# Altium schematic sheet Microcontroller.SchDoc
size A; SheetNumber: 2; SheetTotal: 4
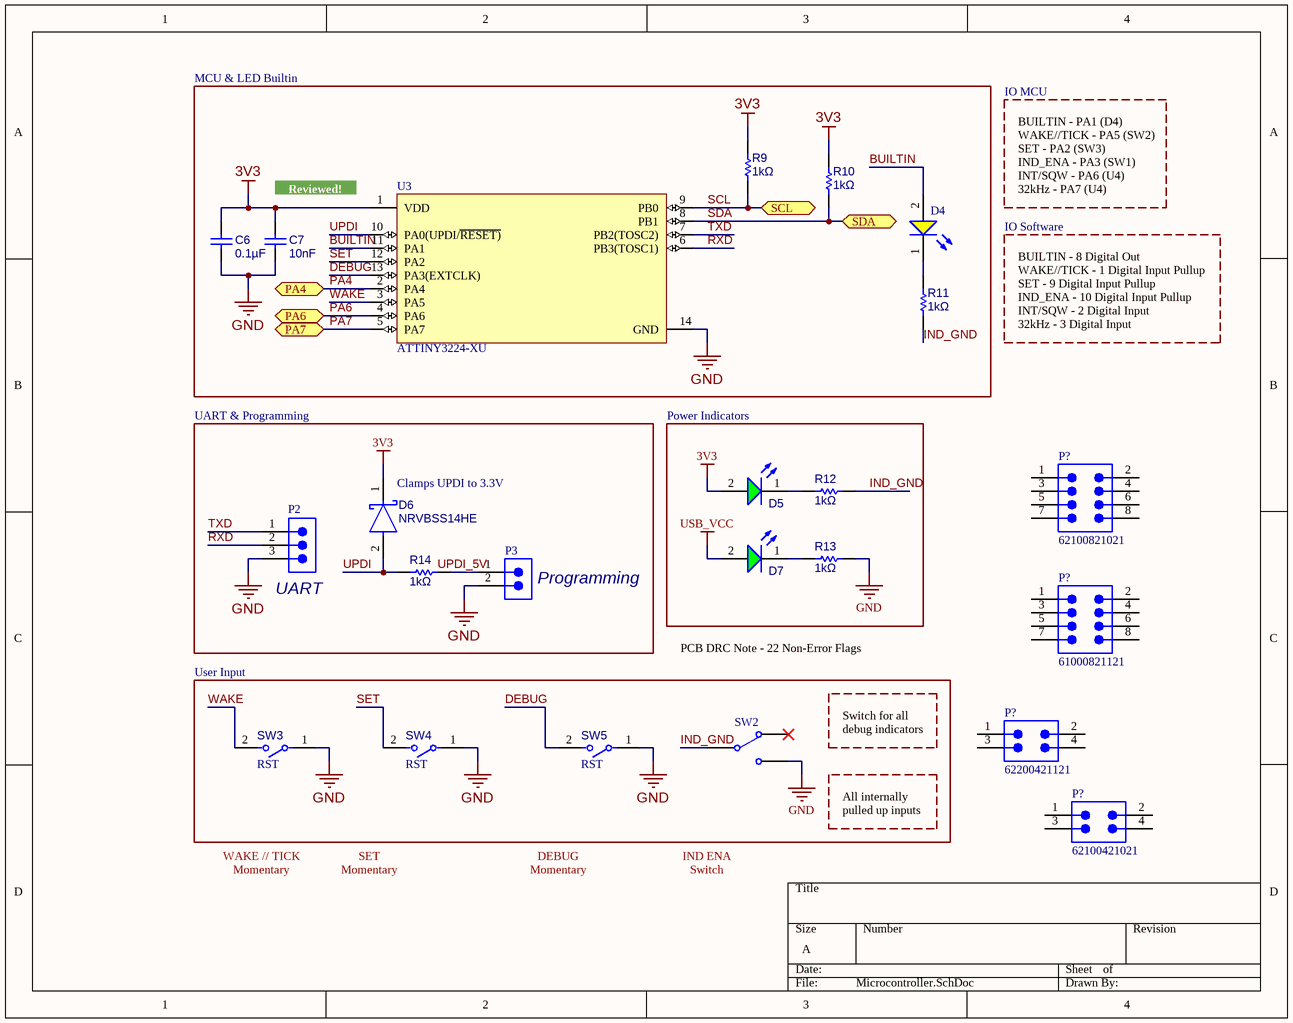
[diagram p0: Microcontroller.SchDoc]

## Parts
(Parts that share a designator on the sheet are numbered #1, #2 ... from top to bottom, then left to right.)
C6  0.1µF  [WCAP-CSGP_0603_L1.6W0.8H0.8_Reflow]
C7  10nF  [WCAP-CSGP_0603_L1.6W0.8H0.8_Reflow]
D4  150120YS75000  [WL-SMCW_1206_150120xx75000]  (value not drawn)
D5  150120GS75000  [WL-SMCW_1206_150120xx75000]  (value not drawn)
D6  NRVBSS14HE  [FP-477AD-MFG]
D7  150120GS75000  [WL-SMCW_1206_150120xx75000]  (value not drawn)
P2  61300311121  [61300311121]  (value not drawn)
P3  61300211121  [61300211121]  (value not drawn)
P?#1  62100821021  [62100821021]
P?#2  61000821121  [61000821121]
P?#3  62200421121  [62200421121]
P?#4  62100421021  [62100421021]
R9  1kΩ  [RESC1608X55X25NL10T15]
R10  1kΩ  [RESC1608X55X25NL10T15]
R11  1kΩ  [RESC1608X55X25NL10T15]
R12  1kΩ  [RESC1608X55X25NL10T15]
R13  1kΩ  [RESC1608X55X25NL10T15]
R14  1kΩ  [RESC1608X55X25NL10T15]
SW2  450404015514  [450404015514]  (value not drawn)
SW3  RST  [FP-B3U-1000P-B-MFG]
SW4  RST  [FP-B3U-1000P-B-MFG]
SW5  RST  [FP-B3U-1000P-B-MFG]
U3  ATTINY3224-XU  [FP-C04-087-ST-MFG]

## Blocks framed on the sheet
MCU & LED Builtin: C6 C7 D4 R9-R11 U3
Power Indicators: D5 D7 R12 R13
User Input: SW2-SW5

## Ports
PA4 (bidir), PA6 (bidir), PA7 (bidir), SCL (bidir, see Display[2B], ICs[2C], ICs[3B], ICs[4B], ICs[4C]), SDA (bidir, see Display[2B], ICs[2C], ICs[3B], ICs[4B], ICs[4C])

## Nets
3V3: C6.2 C7.2 D5.2(A) D6.1(C) R9.2 R10.2 U3.1(VDD)
GND: C6.1 C7.1 P2.3 P3.2 R13.1 SW2.L2 SW3.1 SW4.1 SW5.1 U3.14(GND)
USB_VCC: D7.2(A)
BUILTIN: D4.2(A) U3.11(PA1)
DEBUG: SW5.2 U3.13(PA3(EXTCLK))
IND_GND: R11.1 R12.1 SW2.COM
PA4: U3.2(PA4) ; port PA4
PA6: U3.4(PA6) ; port PA6
PA7: U3.5(PA7) ; port PA7
RXD: P2.2 U3.6(PB3(TOSC1))
SCL: R9.1 U3.9(PB0) ; port SCL
SDA: R10.1 U3.8(PB1) ; port SDA
SET: SW4.2 U3.12(PA2)
TXD: P2.1 U3.7(PB2(TOSC2))
UPDI: D6.2(A) R14.2 U3.10(PA0(UPDI/~{RESET)})
WAKE: SW3.2 U3.3(PA5)
NetD4_1: D4.1(K) R11.2
NetD5_1: D5.1(K) R12.2
NetD7_1: D7.1(K) R13.2
NetP3_1: P3.1 R14.1

Not connected (* = marked no-connect by the designer): P?#1 1 2 3 4 5 6 7 8; P?#2 1 2 3 4 5 6 7 8; P?#3 1 2 3 4; P?#4 1 2 3 4; SW2 L1*

## Notes on the sheet
- IO MCU
- BUILTIN - PA1 (D4)
- WAKE//TICK - PA5 (SW2)
- SET - PA2 (SW3)
- IND_ENA - PA3 (SW1)
- Reviewed!
- IO Software
- INT/SQW - PA6 (U4)
- 32kHz - PA7 (U4)
- BUILTIN - 8 Digital Out
- WAKE//TICK - 1 Digital Input Pullup
- SET - 9 Digital Input Pullup
- IND_ENA - 10 Digital Input Pullup
- INT/SQW - 2 Digital Input
- 32kHz - 3 Digital Input
- UART & Programming
- (near D6) Clamps UPDI to 3.3V
- (near P2) UART
- (near P3) Programming
- PCB DRC Note - 22 Non-Error Flags
- Switch for all debug indicators
- All internally pulled up inputs
- WAKE // TICK
- Momentary
- SET
- DEBUG
- IND ENA
- Switch
- Labels drawn without touching a wire or pin: UPDI_5V

## Library data of the parts
C6 C7 = CMP-207839-000060-3: 10V tolerance
D4 = CMP-1426-00019-3: Led, Yellow, 590 Nm, 2 V, 30 Ma, 120 Mcd Rohs Compliant: Yes; Dominant Wavelength: 590nm; Forward Voltage: 2V; Forward Current: 100mA; Viewing Angle: 140°; Max Reverse Voltage (DC): 5V; Peak Wavelength: 595nm; Lens Style: Clear, Rectangular; Test Current: 20mA; Luminous Intensity: 120mcd; REACH SVHC: Unknown; Length: 3.2mm; RoHS: Compliant; Packaging: Tape and Reel; Min Operating Temperature: -40°C; Mount: Surface Mount; Max Operating Temperature: 85°C; Wavelength: 590nm; Case/Package: 1206; Case Code (Imperial): 1206; Color: Yellow; Height: 680µm; Case Code (Metric): 3216; Width: 1.6mm
D5 D7 = CMP-1426-00014-4: WL-SMCW SMT Mono-Color Chip LED Waterclear; Dominant Wavelength: 525nm; Reverse Voltage: 5V; Max Junction Temperature (Tj): 95°C; Lens Style: Clear, Rectangular; Forward Voltage: 3.2V; Power Dissipation: 105mW; Peak Wavelength: 515nm; Test Current: 20mA; Color: Green; Forward Current: 100mA; Luminous Intensity: 450mcd; Viewing Angle: 140°; Case Code (Imperial): 1206; REACH SVHC: Unknown; Packaging: Tape and Reel; Max Operating Temperature: 85°C; Case/Package: 1206; Height: 680µm; Length: 3.2mm; Mount: Surface Mount; Min Operating Temperature: -40°C; Width: 1.6mm; Case Code (Metric): 3216; Max Reverse Voltage (DC): 5V; RoHS: Compliant; Wavelength: 525nm
D6 = CMP-00278-93203856-2: NRVBSS14HE Rectifier Diode, Schottky, 1 Phase, 1 Element, 1A, 40V V(RRM), Silicon; Manufacturer Lifecycle Status: ACTIVE; Capacitance: 55pF; Max Forward Surge Current (Ifsm): 25A; Peak Reverse Current: 5µA; Max Junction Temperature (Tj): 150°C; Forward Current: 1A; Min Operating Temperature: -55°C; NexarPartId: 93203856; Reverse Voltage: 40V; Max Operating Temperature: 150°C; RoHS: Compliant; Lifecycle Status: Production; Max Repetitive Reverse Voltage (Vrrm): 40V; Height: 750µm
P2 = CMP-1502-01062-3: NexarPartId: 32855521; Current Rating: 3A; Voltage Rating: 250V; Number of Positions: 3; Pitch: 2.54mm; Contact Resistance: 20mΩ; Connector Type: Male Pin; Gender: Male; REACH SVHC: Unknown; Packaging: Bulk; Contact Material: Copper; Min Operating Temperature: -40°C; Number of Rows: 1; Orientation: Vertical; RoHS: Compliant; Contact Plating: Gold; Max Operating Temperature: 105°C; Mount: Through Hole; Height: 8.94mm; Operating Supply Voltage: 250V; Number of Pins: 3; Contact Mating Length: 5.9944mm; Number of Contacts: 3; Color: Black; Lead Free: Lead Free; Lead Pitch: 2.54mm; Termination: Solder
P3 = CMP-1712-00002-6: NexarPartId: 20081794; Number of Contacts: 2; Pitch: 2.54mm; Connector Type: Male Pin; Voltage Rating: 250V; Current Rating: 3A; Gender: Male; Contact Resistance: 20mΩ; Height: 8.94mm; Lead Free: Lead Free; Number of Pins: 2; Termination: Through Hole; RoHS: Compliant; Lead Pitch: 2.54mm; REACH SVHC: No SVHC; Housing Material: PBT; Contact Mating Length: 5.9944mm; Min Operating Temperature: -40°C; Orientation: Vertical; Contact Material: Copper; Contact Gender: Male; Max Operating Temperature: 125°C; Number of Rows: 1; Number of Positions: 2; Packaging: Bulk; Contact Plating: Gold; Mount: Through Hole; Color: Black; Operating Supply Voltage: 250V
P?#1 = CMP-1502-00926-4: Conn, Header, 8Pos, 2Row, 1.27Mm Rohs Compliant: Yes; Contact Resistance: 20mΩ; Current Rating: 1A; Operating Supply Voltage: 100V; Gender: Male; RoHS: Non-Compliant; Orientation: Vertical; Lead Pitch: 1.27mm; Number of Pins: 8
P?#2 = CMP-1502-01025-4: SMT Vertical Pin Header WR-PHD, Pitch 2.54 mm, Dual Row, 8 pins; Number of Contacts: 8; Connector Type: Male Pin; Contact Resistance: 20mΩ; Operating Supply Voltage: 250V; Gender: Male; Pitch: 2.54mm; Current Rating: 3A; Mount: Surface Mount; Lead Pitch: 2.54mm; Color: Black; RoHS: Compliant; Number of Pins: 8; Orientation: Vertical; Contact Mating Length: 5.9944mm; Number of Rows: 2; Row Spacing: 2.54mm; Termination: Solder; Number of Positions: 8; Contact Material: Copper; Contact Plating: Gold
P?#3 = CMP-1502-00946-4: THT Vertical Pin Header WR-PHD, Pitch 1.27 mm, Dual Row, 4 pins; Row Spacing: 1.27mm; Gender: Male; Number of Positions: 4; Contact Resistance: 20mΩ; Current Rating: 1A; Operating Supply Voltage: 100V; Connector Type: Male Pin; Pitch: 1.27mm; Termination: Solder; Packaging: Box; Contact Mating Length: 3.81mm; Number of Pins: 4; Color: Black; Number of Contacts: 4; Contact Material: Copper; Orientation: Vertical; RoHS: Compliant; Mount: Through Hole; Lead Pitch: 1.27mm; Contact Plating: Gold; Number of Rows: 2
P?#4 = CMP-1502-00925-4: Conn, Header, 4Pos, 2Row, 1.27Mm Rohs Compliant: Yes; Current Rating: 1A; Contact Resistance: 20mΩ; Operating Supply Voltage: 100V; Gender: Male; Lead Pitch: 1.27mm; Number of Pins: 4; Orientation: Vertical; RoHS: Non-Compliant
R9-R14 = CMP-2000-04186-1
SW2 = CMP-03913-99472344-1: 450404015514 Slide Switch, 0.3A, 5Vdc, Smd Rohs Compliant: Yes; Current Rating: 300mA; Insulation Resistance: 100MΩ; Voltage Rating: 5V; NexarPartId: 99472344; Min Operating Temperature: -40°C; Contact Plating: Silver; Packaging: Tape and Reel; Max Operating Temperature: 85°C; RoHS: Compliant
SW3-SW5 = CMP-08834-000005-1: SWITCH TACTILE SPST-NO 0.05A 12V; Manufacturer Part Number: B3U-1000P-B; Manufacturer: Omron; Operating Force: 1.5N; Contact Current Rating: 50mA; Contact Resistance: 100mΩ; Electromechanical Life: 200000Cycles; Height: 1.75mm; Device Class L2: Switches; Temperature Range High: +70°C; Digikey Description: SWITCH TACTILE SPST-NO 0.05A 12V; Throw Configuration: SPST-NO; Ambient Temperature Range High: +70°C; Temperature: -25°C to +70°C; Lead Free: Yes; ComponentLink2URL: https://omronfs.omron.com/en_US/ecb/products/pdf/en-b3u.pdf; Device Class L3: Tactile Switches; Ambient Temperature Range Low: -25°C; Mount: Surface Mount; Automotive: No; Mouser Description: Tactile Switches Top Actuated with boss w/o ground; Octopart: https://octopart.com/b3u-1000p-b-omron-1057356; RoHS: TRUE; Package: 0; Device Class L1: Electromechanical; Voltage Rating Dc: 12V; Category: Switch; Temperature Range Low: -25°C; ComponentLink2Description: Datasheet
U3 = CMP-00252-122240563-1: ATTINY3224-XU Microcontroller 8-Bit AVR RISC 32KB Flash 1.8V to 5.5V 14-Pin TSSOP Tube; NexarPartId: 122240563